# EAGLE schematic baskettarget_V2 (EAGLE 9.6.2)
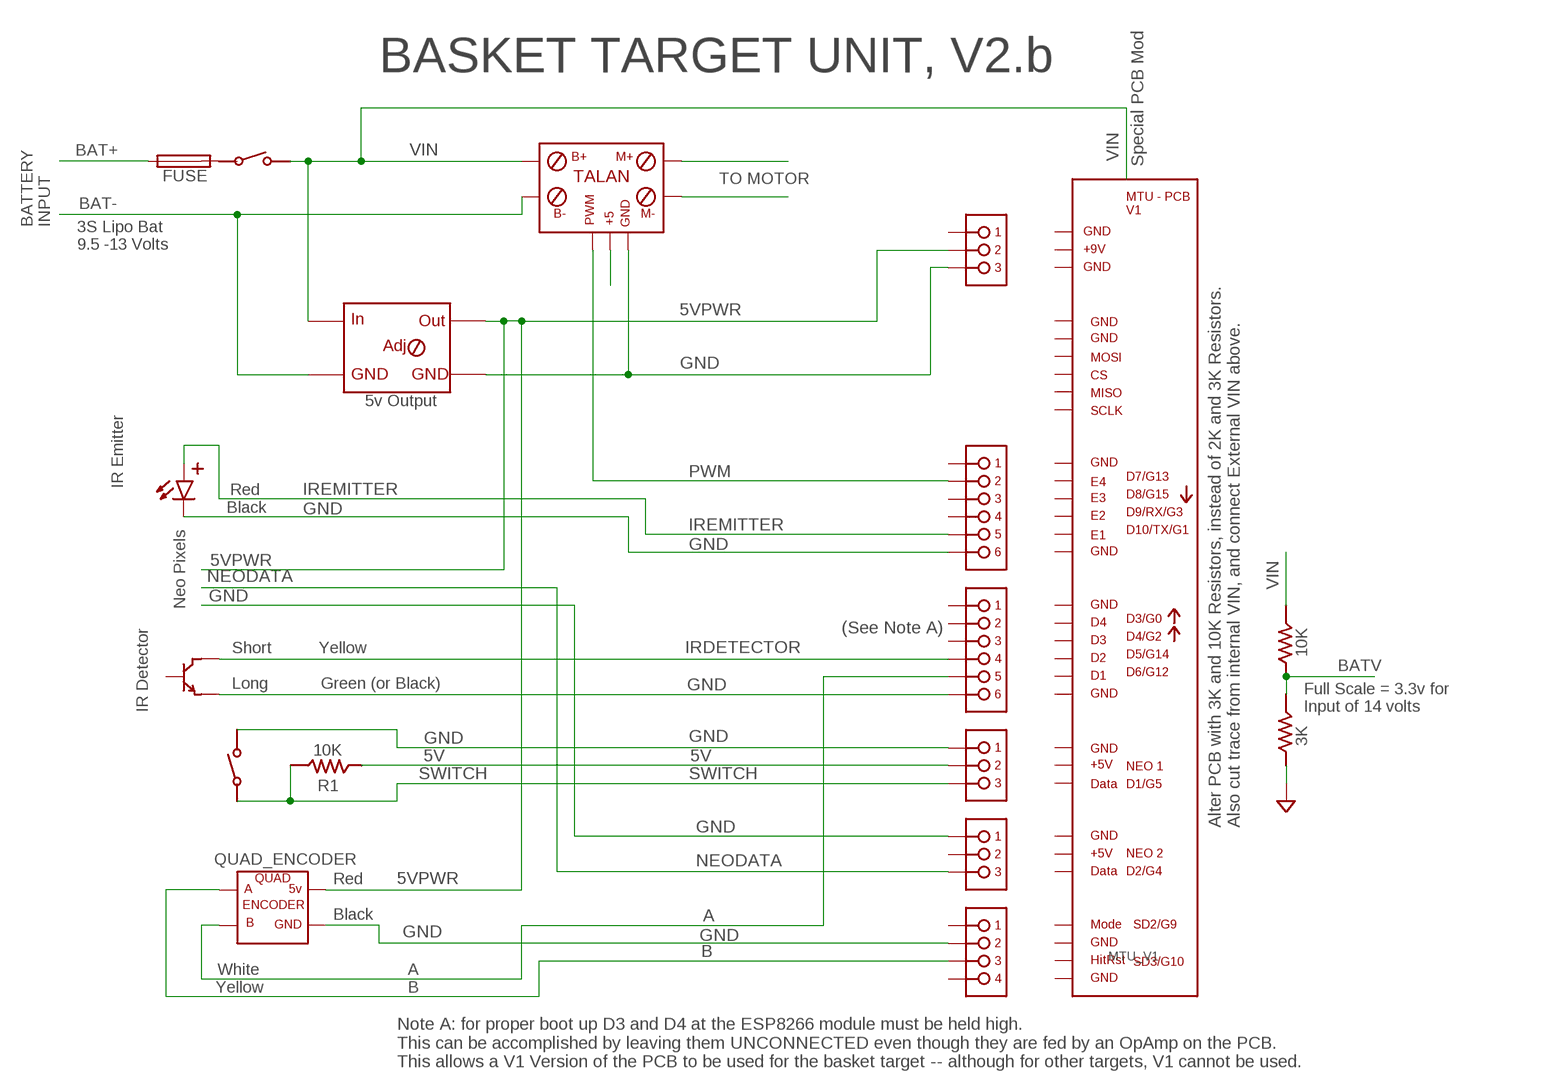
[diagram p0: schematic, sheet 1]

## Parts
F2  FUSE  FUSE19596  [FUSE_HOLDER_WICKMANN-19596]
J1  ENCODER  PINHDR_1X4TH_VERT_100  [PINHDR_TH_100_1X4]
J2  NEO  PINHDR_1X3-100  [PINHDR_TH_100_1X3]
J4  INPUTS  PINHDR_1X6-100  [PINHDR_TH_100_1X6]
J6  OUTPUTS  PINHDR_1X6-100  [PINHDR_TH_100_1X6]
J7  PWR  PINHDR_1X3-100  [PINHDR_TH_100_1X3]
J10  SERVO  PINHDR_1X3-100  [PINHDR_TH_100_1X3]
LED1  IR Emitter  LEDTH-DIP-100  [LED-TH100]
M1  MTU_V1  [MTU_V1]
M2  TALAN  [TALAN_PWM]
M4  5v Output  DC_DC_MODULE  [DC_DC_MODULE]
R1  10K  RTHOLE300  [R300]
R10  10K  RTHOLE300  [R300]
R11  3K  RTHOLE300  [R300]
S1  TOGGLE_SPST  [SPST_TOGGLE]
S2  TOGGLE_SPST  [SPST_TOGGLE]
T1  T_NPN  [TO-92]
U2  QUAD_ENCODER  [QUAD_ENCODER]

## Nets
5V: J2.2 R1.P$1
5VPWR: J7.2 M4.OUT+(OUT) U2.5V
A: J4.5 U2.B
B: J1.3 U2.A
BAT+: F2.A
BAT-: M2.B- M4.IN-(G1)
BATV: R10.P$1 R11.P$2
GND: J1.2 J2.1 J4.6 J6.6 J7.3 J10.1 LED1.P$2(CATHODE) M2.GND M4.OUT-(G2) R11.P$1 S1.P$2 T1.P$3(EMITTER) U2.GND
IRDETECTOR: J4.4 T1.P$1(COLLECTOR)
IREMITTER: J6.5 LED1.P$1(ANODE)
N$1: F2.B S2.P$1
N$11: M2.M+
N$15: M2.M-
N$16: M2.5V
NEODATA: J10.3
PWM: J6.2 M2.PWM
SWITCH: J2.3 R1.P$2 S1.P$1
VIN: M2.B+ M4.IN+(IN) R10.P$2 S2.P$2
Unconnected: J1.1 J1.4 J4.1 J4.2 J4.3 J6.1 J6.3 J6.4 J7.1 J10.2 M1.P$1 M1.P$2 M1.P$3 M1.P$4 M1.P$5 M1.P$6 M1.P$7 M1.P$8 M1.P$9 M1.P$10 M1.P$11 M1.P$12 M1.P$13 M1.P$14 M1.P$15 M1.P$16 M1.P$17 M1.P$18 M1.P$19 M1.P$20 M1.P$21 M1.P$22 M1.P$23 M1.P$24 M1.P$25 M1.P$26 M1.P$27 M1.P$28 M1.P$29 M1.P$30 M1.P$31 T1.P$2(BASE)

## Notes on the sheet
- BASKET TARGET UNIT, V2.b
- Special PCB Mod
- TO MOTOR
- BATTERY
  INPUT
- 3S Lipo Bat
  9.5 -13 Volts
- IR Emitter
- Red
- Black
- Neo Pixels
- (See Note A)
- Short | Yellow
- Long | Green (or Black)
- IR Detector
- Full Scale = 3.3v for 
  Input of 14 volts
- Alter PCB with 3K and 10K Resistors, instead of 2K and 3K Resistors.
  Also cut trace from internal VIN, and connect External VIN above.
- Red
- Black
- White
- Yellow
- Note A: for proper boot up D3 and D4 at the ESP8266 module must be held high. 
  This can be accomplished by leaving them UNCONNECTED even though they are fed by an OpAmp on the PCB.
  This allows a V1 Version of the PCB to be used for the basket target -- although for other targets, V1 cannot be used.

## Library data of the parts
F2 = fuse:FUSE: Fuse; OC_FARNELL: 1271669; OC_NEWARK: unknown
J1 = Dal_V2:PINHDR_1X4
J2 J7 J10 = Dal_V2:PINHDR_1X3
J4 J6 = Dal_V2:PINHDR_1X6
LED1 = Dal_V2:LED: Standard LED
M1 = EpicFMSLib:MTU_V1
M2 = Dal_V2:TALAN
M4 = Dal_V2:DC_DC_MODULE
R1 R10 R11 = Dal_V2:R: Standard Resistor -- Various Sizes and Wattages
S1 S2 = Dal_V2:TOGGLE_SPST
T1 = Dal_V2:T_NPN
U2 = Dal_V2:QUAD_ENCODER